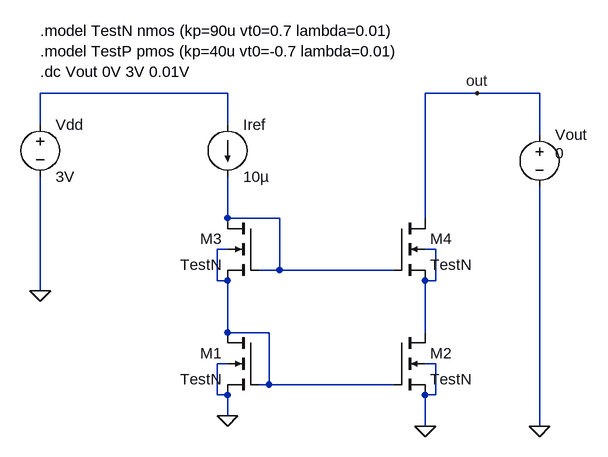
[diagram p0: schematic with_cascode.asc]
with_cascode.asc, the LTspice schematic file:
Version 4
SHEET 1 880 1428
WIRE -400 896 -688 896
WIRE -16 896 -96 896
WIRE 80 896 -16 896
WIRE -688 944 -688 896
WIRE -400 944 -400 896
WIRE 80 960 80 896
WIRE -400 1088 -400 1024
WIRE -320 1088 -400 1088
WIRE -96 1088 -96 896
WIRE -400 1136 -416 1136
WIRE -80 1136 -96 1136
WIRE -320 1168 -320 1088
WIRE -320 1168 -352 1168
WIRE -144 1168 -320 1168
WIRE -416 1184 -416 1136
WIRE -400 1184 -416 1184
WIRE -80 1184 -80 1136
WIRE -80 1184 -96 1184
WIRE -688 1200 -688 1024
WIRE -400 1264 -400 1184
WIRE -336 1264 -400 1264
WIRE -96 1264 -96 1184
WIRE -400 1312 -416 1312
WIRE -80 1312 -96 1312
WIRE -336 1344 -336 1264
WIRE -336 1344 -352 1344
WIRE -144 1344 -336 1344
WIRE -416 1360 -416 1312
WIRE -400 1360 -416 1360
WIRE -80 1360 -80 1312
WIRE -80 1360 -96 1360
WIRE -400 1392 -400 1360
WIRE -96 1408 -96 1360
WIRE 80 1408 80 1040
FLAG -400 1392 0
FLAG -688 1200 0
FLAG -96 1408 0
FLAG 80 1408 0
FLAG -16 896 out
SYMBOL voltage 80 944 R0
WINDOW 3 24 44 Left 2
WINDOW 123 0 0 Left 2
WINDOW 39 0 0 Left 2
SYMATTR Value 0
SYMATTR InstName Vout
SYMBOL current -400 944 R0
WINDOW 123 0 0 Left 2
WINDOW 39 0 0 Left 2
SYMATTR InstName Iref
SYMATTR Value 10µ
SYMBOL voltage -688 928 R0
SYMATTR InstName Vdd
SYMATTR Value 3V
SYMBOL nmos4 -352 1264 M0
SYMATTR InstName M1
SYMATTR Value TestN
SYMATTR Value2 l=10u w=10u
SYMBOL nmos4 -144 1264 R0
SYMATTR InstName M2
SYMATTR Value TestN
SYMATTR Value2 l=10u w=100u
SYMBOL nmos4 -144 1088 R0
SYMATTR InstName M4
SYMATTR Value TestN
SYMATTR Value2 l=10u w=100u
SYMBOL nmos4 -352 1088 M0
SYMATTR InstName M3
SYMATTR Value TestN
SYMATTR Value2 l=10u w=10u
TEXT -688 800 Left 2 !.model TestN nmos (kp=90u vt0=0.7 lambda=0.01)\n.model TestP pmos (kp=40u vt0=-0.7 lambda=0.01)\n.dc Vout 0V 3V 0.01V

The netlist it stands for:
* with_cascode.asc
Vout out 0 0
Iref N001 N002 10µ
Vdd N001 0 3V
M1 N003 N003 0 0 TestN l=10u w=10u
M2 N004 N003 0 0 TestN l=10u w=100u
M4 out N002 N004 N004 TestN l=10u w=100u
M3 N002 N002 N003 N003 TestN l=10u w=10u
.model NMOS NMOS
.model PMOS PMOS
.lib standard.mos
.model TestN nmos (kp=90u vt0=0.7 lambda=0.01)
.model TestP pmos (kp=40u vt0=-0.7 lambda=0.01)
.dc Vout 0V 3V 0.01V
.backanno
.end